# Altium project imu-pcb.PrjPcb
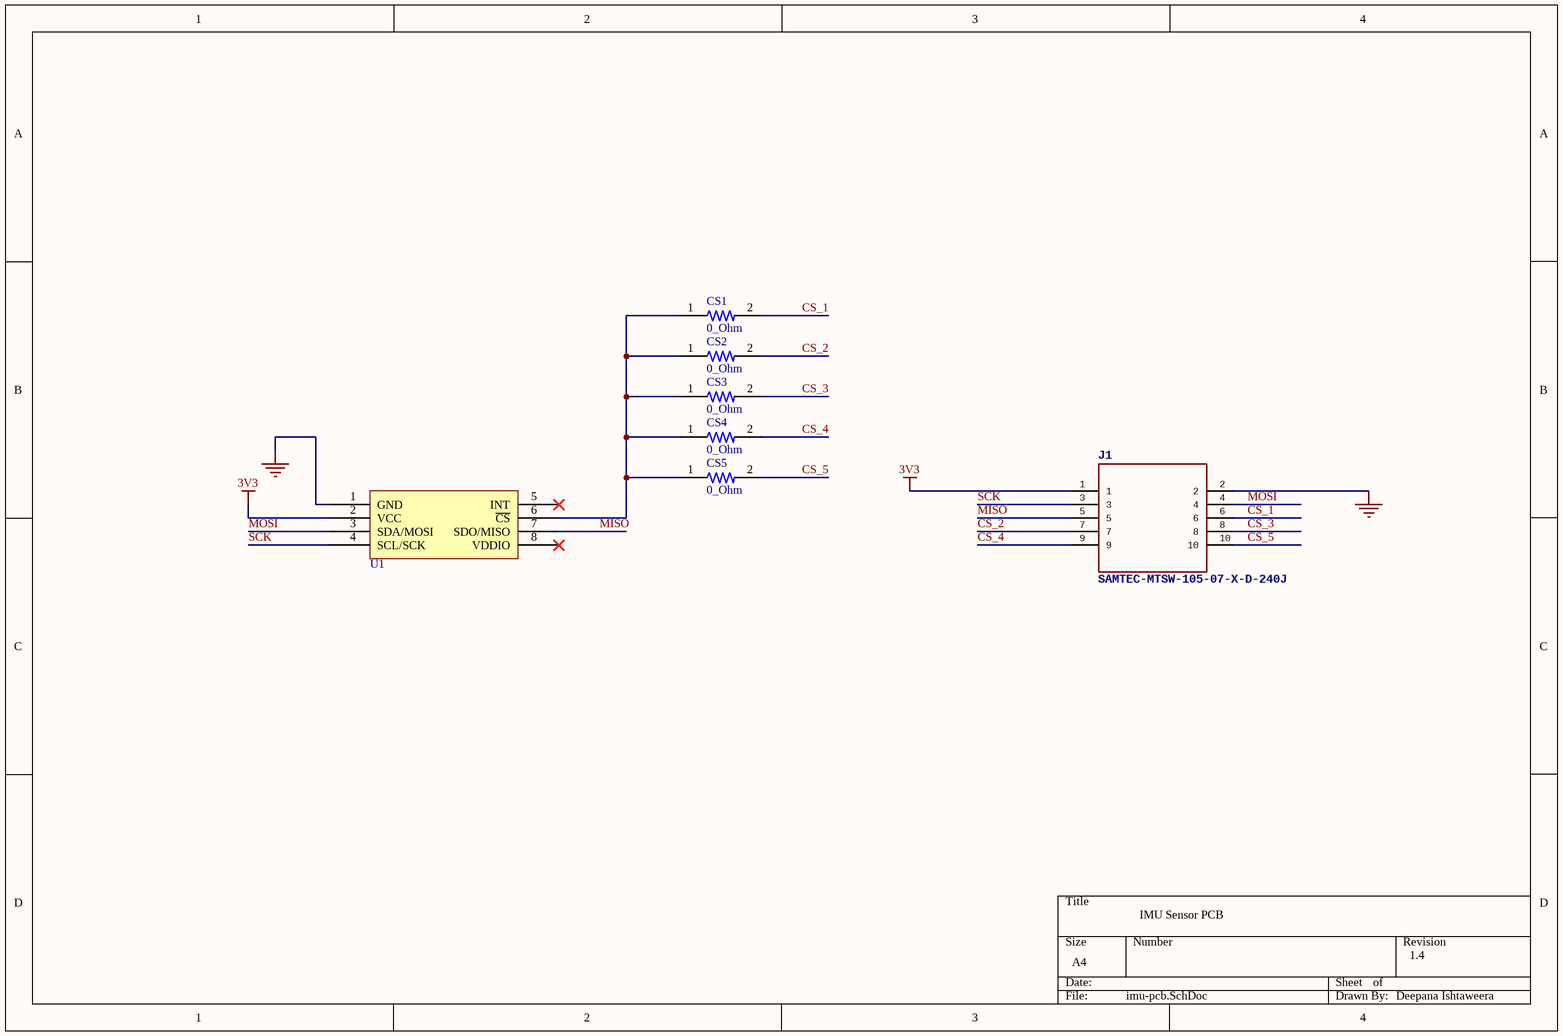
[diagram p0: imu-pcb.SchDoc]
1 sheet, 7 parts. Net scope: global (net labels, ports and power ports of the same name join across sheets).
Board file: imu-pcb.PcbDoc

## Sheet imu-pcb.SchDoc
size A4

### Parts
CS1  0_Ohm  [RESC1608X50N]
CS2  0_Ohm  [RESC1608X50N]
CS3  0_Ohm  [RESC1608X50N]
CS4  0_Ohm  [RESC1608X50N]
CS5  0_Ohm  [RESC1608X50N]
J1  SAMTEC-MTSW-105-07-X-D-240J  [IDC_2.54_10]
U1  Sparkfun_MPU9250  [Sparkfun_MPU9250]  (value not drawn)

### Nets
3V3: J1.1 U1.2(VCC)
GND: J1.2 U1.1(GND)
CS_1: CS1.2 J1.6
CS_2: CS2.2 J1.7
CS_3: CS3.2 J1.8
CS_4: CS4.2 J1.9
CS_5: CS5.2 J1.10
MISO: J1.5 U1.7(SDO/MISO)
MOSI: J1.4 U1.3(SDA/MOSI)
SCK: J1.3 U1.4(SCL/SCK)
NetCS1_1: CS1.1 CS2.1 CS3.1 CS4.1 CS5.1 U1.6(~{CS})

Not connected (* = marked no-connect by the designer): U1 5(INT)* 8(VDDIO)*

### Notes on the sheet
- IMU Sensor PCB
- 1.4
- Deepana Ishtaweera

### Library data of the parts
CS1-CS5 = RES-0603_0: RES SMD 10 OHM 0.1% 1/16W 0603; Voltage_Rating: 50 V; Power_Rating: .063 W; Resistance: 10; MF: TE Connectivity; MP: 8-1614350-7; Tolerance: .1%; Availability: Warning; Price: None; SnapEDA_Link: https://www.snapeda.com/parts/8-1614350-7/TE%20Connectivity/view-part/2208042/?ref=snap; EU_RoHS_Compliance: Compliant; Value: *; Package: 0603; Comment_1: *
J1 = IDC_2.54mm_10pos: 5x2 male connector (2.54mm)
U1 = Sparkfun_MPU9250: https://learn.sparkfun.com/tutorials/mpu-9250-hookup-guide/all#resources-and-going-further